# EAGLE design LoRa_Plug (EAGLE 9.2.0)
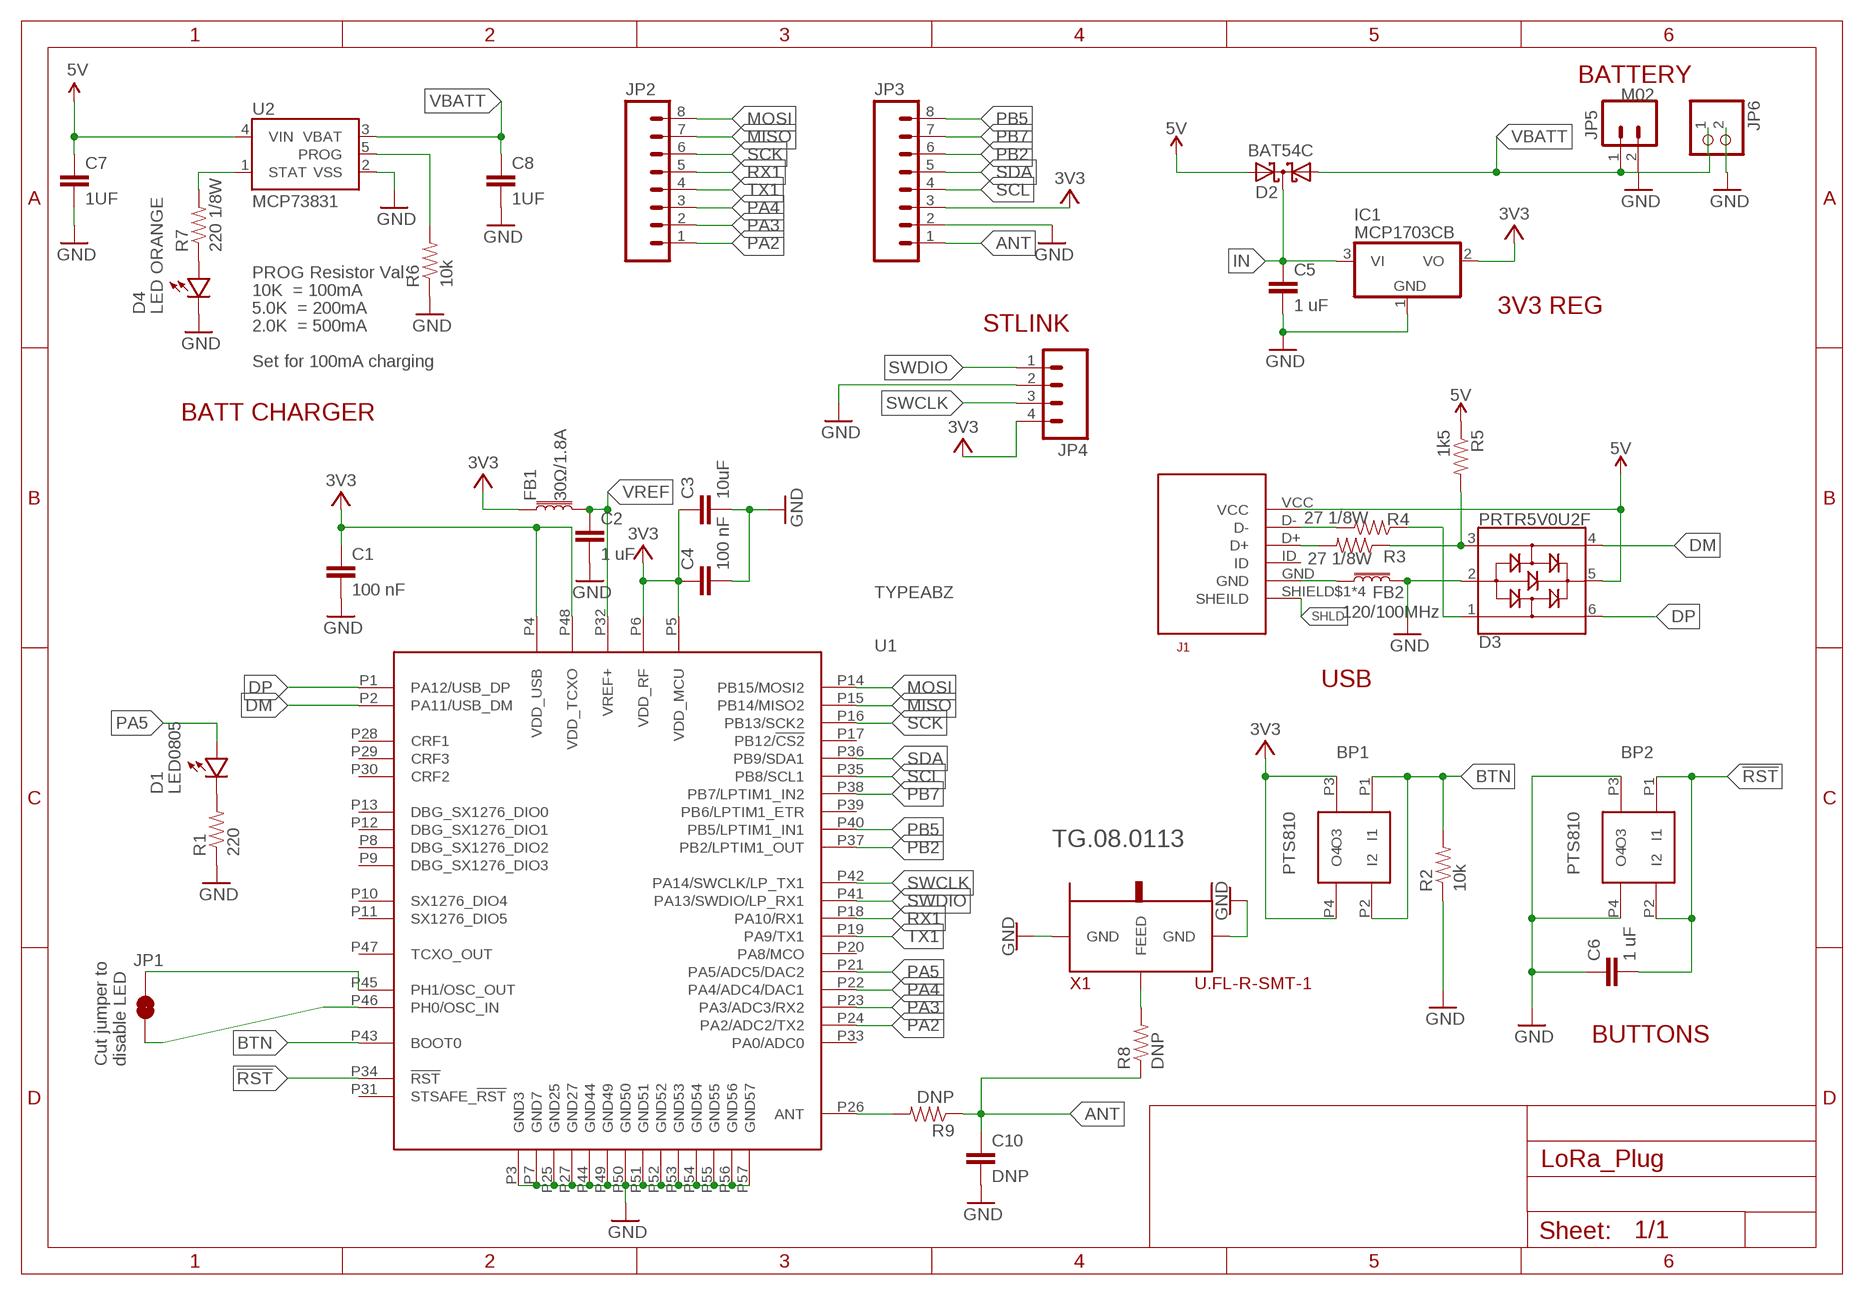
[diagram p0: schematic, sheet 1]

## Parts
BP1  PTS810  C&KTACTILESWITCH  [C&KTACTILESWITCH]
BP2  PTS810  C&KTACTILESWITCH  [C&KTACTILESWITCH]
C1  100 nF  CAP0603-CAP  [0603-CAP]
C2  1 uF  CAP0603-CAP  [0603-CAP]
C3  10uF  CAP0603-CAP  [0603-CAP]
C4  100 nF  CAP0603-CAP  [0603-CAP]
C5  1 uF  CAP0603-CAP  [0603-CAP]
C6  1 uF  CAP0603-CAP  [0603-CAP]
C7  1UF  CAP0603-CAP  [0603-CAP]
C8  1UF  CAP0603-CAP  [0603-CAP]
C10  DNP  CAP0603-CAP  [0603-CAP]
D1  LED0805  [0805-LED]
D2  BAT54C  [SOT23]
D3  PRTR5V0U2F  [SOT886]
D4  LED ORANGE  LED0805  [0805-LED]
FB1  30Ω/1.8A  FERRITE_BEAD-0603  [0603]
FB2  120/100MHz  FERRITE_BEAD-0603  [0603]
IC1  MCP1703CB  [SOT23]
J1  10118193-0001LF  [10118193-0001LF]
JP1  JUMPER-SMT_2_NC_TRACE_SILK  [SMT-JUMPER_2_NC_TRACE_SILK]
JP2  M08  [1X08]
JP3  M08  [1X08]
JP4  M04PTH  [1X04]
JP5  M02  [1X02]
JP6  JST_2PIN-THM  [JST-PH-2-THM]
R1  220  RESISTOR0603-RES  [0603-RES]
R2  10k  RESISTOR0603-RES  [0603-RES]
R3  27 1/8W  RESISTOR0603-RES  [0603-RES]
R4  27 1/8W  RESISTOR0603-RES  [0603-RES]
R5  1k5  RESISTOR0603-RES  [0603-RES]
R6  10k  RESISTOR0603-RES  [0603-RES]
R7  220 1/8W  RESISTOR0805  [0805]
R8  DNP  RESISTOR0603-RES  [0603-RES]
R9  DNP  RESISTOR0603-RES  [0603-RES]
U1  TYPEABZ  [TYPEABZ]
U2  MCP73831  [SOT23-5:1]
X1  U.FL-R-SMT-1  [U.FL-R-SMT-1]

## Nets
3V3: BP1.P3(O3) BP1.P4(O4) C1.1 C3.1 C4.1 FB1.1 IC1.2(VO) JP3.3 JP4.4 U1.P4(VDD_USB) U1.P5(VDD_MCU) U1.P6(VDD_RF) U1.P48(VDD_TCXO)
5V: C7.1 D2.2(A2) D3.5 J1.VCC R5.1 U2.4(VIN)
!RST: BP2.P1(I1) BP2.P2(I2) C6.2 U1.P34(!RST)
ANT: C10.1 JP3.1 R8.1 R9.1
BTN: BP1.P1(I1) BP1.P2(I2) R2.2 U1.P43(BOOT0)
DM: D3.4 U1.P2(PA11/USB_DM)
DP: D3.6 U1.P1(PA12/USB_DP)
GND: BP2.P3(O3) BP2.P4(O4) C1.2 C2.2 C3.2 C4.2 C5.2 C6.1 C7.2 C8.2 C10.2 D3.2 D4.MINUS FB2.2 IC1.1(GND) JP3.2 JP4.2 JP5.2 JP6.2 R1.1 R2.1 R6.1 U1.P3(GND3) U1.P7(GND7) U1.P25(GND25) U1.P27(GND27) U1.P44(GND44) U1.P49(GND49) U1.P50(GND50) U1.P51(GND51) U1.P52(GND52) U1.P53(GND53) U1.P54(GND54) U1.P55(GND55) U1.P56(GND56) U1.P57(GND57) U2.2(VSS) X1.P$1(GND) X1.P$2(GND)
IN: C5.1 D2.3(CC) IC1.3(VI)
MISO: JP2.7 U1.P15(PB14/MISO2)
MOSI: JP2.8 U1.P14(PB15/MOSI2)
N$1: D1.MINUS R1.2
N$2: R9.2 U1.P26(ANT)
N$6: JP1.2 U1.P45(PH1/OSC_OUT)
N$8: J1.D- R4.2
N$10: J1.D+ R3.2
N$11: FB2.1 J1.GND
N$12: JP1.1 U1.P46(PH0/OSC_IN)
N$15: D4.PLUS R7.1
N$28: R8.2 X1.P$3(FEED)
PA2: JP2.1 U1.P24(PA2/ADC2/TX2)
PA3: JP2.2 U1.P23(PA3/ADC3/RX2)
PA4: JP2.3 U1.P22(PA4/ADC4/DAC1)
PA5: D1.PLUS U1.P21(PA5/ADC5/DAC2)
PB2: JP3.6 U1.P37(PB2/LPTIM1_OUT)
PB5: JP3.8 U1.P40(PB5/LPTIM1_IN1)
PB7: JP3.7 U1.P38(PB7/LPTIM1_IN2)
PROG1: R6.2 U2.5(PROG)
RX1: JP2.5 U1.P18(PA10/RX1)
SCK: JP2.6 U1.P16(PB13/SCK2)
SCL: JP3.4 U1.P35(PB8/SCL1)
SDA: JP3.5 U1.P36(PB9/SDA1)
SHLD: J1.SHIELD$1(SHEILD) J1.SHIELD$2(SHEILD) J1.SHIELD$3(SHEILD) J1.SHIELD$4(SHEILD)
STAT1: R7.2 U2.1(STAT)
SWCLK: JP4.3 U1.P42(PA14/SWCLK/LP_TX1)
SWDIO: JP4.1 U1.P41(PA13/SWDIO/LP_RX1)
TX1: JP2.4 U1.P19(PA9/TX1)
USB_D+: D3.3 R3.1 R5.2
USB_D-: D3.1 R4.1
VBATT: C8.1 D2.1(A1) JP5.1 JP6.1 U2.3(VBAT)
VREF: C2.1 FB1.2 U1.P32(VREF+)
Unconnected: J1.ID U1.P8(DBG_SX1276_DIO2) U1.P9(DBG_SX1276_DIO3) U1.P10(SX1276_DIO4) U1.P11(SX1276_DIO5) U1.P12(DBG_SX1276_DIO1) U1.P13(DBG_SX1276_DIO0) U1.P17(PB12/!CS2) U1.P20(PA8/MCO) U1.P28(CRF1) U1.P29(CRF3) U1.P30(CRF2) U1.P31(STSAFE_!RST) U1.P33(PA0/ADC0) U1.P39(PB6/LPTIM1_ETR) U1.P47(TCXO_OUT)

## Notes on the sheet
- BATTERY
- PROG Resistor Val:
- 10K  = 100mA | 3V3 REG
- 5.0K  = 200mA | STLINK
- 2.0K  = 500mA
- Set for 100mA charging
- BATT CHARGER
- USB
- TG.08.0113
- BUTTONS
- Cut jumper to 
  disable LED

## Library data of the parts
BP1 BP2 = LoRa.v01h:C&KTACTILESWITCH: C&K Tactile Switch 611-PTS810SJS250SMTR
C1-C6 C10 = UNodino:CAP: Capacitor Standard 0603 ceramic capacitor, and 0.1" leaded capacitor.
C7 C8 = UNodino:CAP: Capacitor Standard 0603 ceramic capacitor, and 0.1" leaded capacitor.; STOCK: CAP C22UF 6.3V X5R 0805
D1 = UNodino:LED
D2 = diode:BAT54C: Schottky Diodes Source: Fairchild .. BAT54.pdf
D3 = Nively001:PRTR5V0U2; DIGIKEY: 1727-4161-1-ND
D4 = UNodino:LED; DIGIKEY: 160-1413-2-ND
FB1 = Nively001:FERRITE_BEAD: Ferrite Bead (blocks, cores, rings, chokes, etc.) Inductor with layers of ferrite used to suppress high frequencies. Often used to isolate high frequency noise. SparkFun Products: IOIO-OTG - V2.2 <https://www.sparkfun.com/products/13613> SparkFun SAMD21 Mini Breakout <https://www.sparkfun.com/products/13664> SparkFun 6 Degrees of Freedom Breakout - LSM6DS3 <https://www.sparkfun.com/products/13339> SparkFun SAMD21 Dev Breakout <https://www.sparkfun.com/products/13672>; DIGIKEY: BLM18EG331TN1D; PROD_ID: NDUC-13805
FB2 = Nively001:FERRITE_BEAD: Ferrite Bead (blocks, cores, rings, chokes, etc.) Inductor with layers of ferrite used to suppress high frequencies. Often used to isolate high frequency noise. SparkFun Products: IOIO-OTG - V2.2 <https://www.sparkfun.com/products/13613> SparkFun SAMD21 Mini Breakout <https://www.sparkfun.com/products/13664> SparkFun 6 Degrees of Freedom Breakout - LSM6DS3 <https://www.sparkfun.com/products/13339> SparkFun SAMD21 Dev Breakout <https://www.sparkfun.com/products/13672>; DIGIKEY: BLM18EG331TN1D; PROD_ID: NDUC-13805; VALUE: 30Ω/1.8A
IC1 = gateway_finalV2:MCP1703: 250 mA, 16V, Low Quiescent Current LDO Regulator Source: http://ww1.microchip.com/downloads/en/DeviceDoc/22049b.pdf
J1 = 10118193-0001LF:10118193-0001LF; STOCK: CONN RCPT USB2.0 MICRO B SMD R/A
JP1 = SparkFun-Jumpers:JUMPER-SMT_2_NC_TRACE: Normally closed trace jumper This jumper has a trace between two pads so it's normally closed (NC). Use a razor knife to open the connection. For best results follow the IPC guidelines for cutting traces: Cutout at least 0.063 mm (0.005 in). Remove all loose material to clean up the cut area. Seal the cut with an approved epoxy. Reapply solder to reclose the connection.
JP2 JP3 = SparkFun-2010:M08: Header 8 Standard 8-pin 0.1" header. Use with straight break away headers (SKU : PRT-00116), right angle break away headers (PRT-00553), swiss pins (PRT-00743), machine pins (PRT-00117), and female headers (PRT-00115).
JP4 = SparkFun-2010:M04: Header 4 Standard 4-pin 0.1" header. Use with straight break away headers (SKU : PRT-00116), right angle break away headers (PRT-00553), swiss pins (PRT-00743), machine pins (PRT-00117), and female headers (PRT-00115). Molex polarized connector foot print use with SKU : PRT-08231 with associated crimp pins and housings.
JP5 = SparkFun-Connectors:M02
JP6 = adafruit:JST_2PIN: JST 2-Pin Connectors of various flavors SMT-RA (S2B-PH-SM4) 4UConnector #17311 SMT (B2B-PH-SM4) THM-RA (S2B-PH) THM (B2B-PH)
R1 R2 R8 R9 = UNodino:RESISTOR: Resistor Basic schematic elements and footprints for 0603, 1206, and PTH resistors.
R3-R5 = UNodino:RESISTOR: Resistor Basic schematic elements and footprints for 0603, 1206, and PTH resistors.; STOCK: RES SMD 27 OHM 5% 1/8W 0805
R6 = UNodino:RESISTOR: Resistor Basic schematic elements and footprints for 0603, 1206, and PTH resistors.; STOCK: RES SMD 2K2 OHM 5% 1/10W 0603
R7 = UNodino:RESISTOR: Resistor Basic schematic elements and footprints for 0603, 1206, and PTH resistors.; DIGIKEY: A129741TR-ND
U1 = LoRa.v01h:TYPEABZ: CMWX1ZZABZ-078
U2 = Nively001:MCP73831: Miniature single cell, fully integrated Li-Ion, Li-polymer charge management controller http://ww1.microchip.com/downloads/en/DeviceDoc/20001984g.pdf IC-09995; DIGIKEY: MCP73831T-2DCI/OTCT-ND; PROD_ID: IC-09995
X1 = gateway_finalV2:U.FL-R-SMT-1: Connecteur coaxial / RF, Coaxial U.FL, Jack droit, Montage en surface vertical, 50 ohm, Laiton; STOCK: U.FL-R-SMT-1(10) - Connecteur coaxial / RF, Coaxial U.FL

## Net classes
0 default: clearance 0.127 mm

## Board
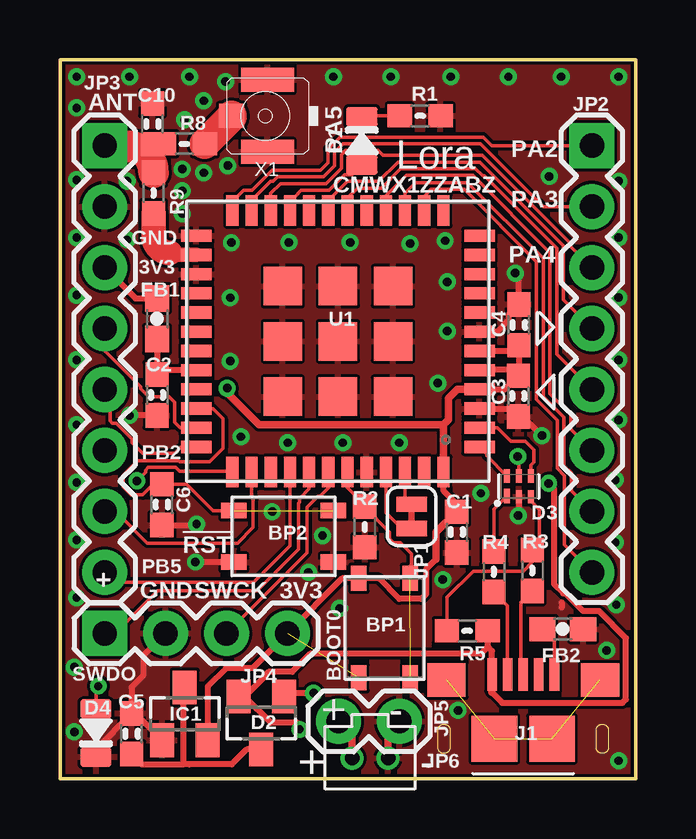
[diagram p1: board, top side]
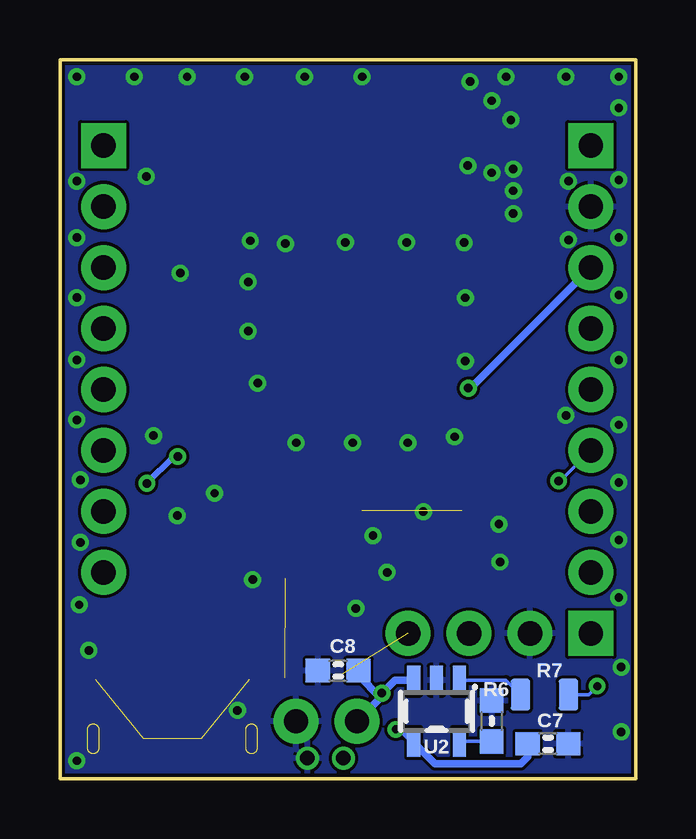
[diagram p2: board, bottom side, seen from below]

Size 24 x 29.94 mm. Coordinates in mm from the lower left corner, seen from the top.
Outline: 24,29.94 0,29.94 0,0 24,0 24,29.94
Copper layers (1*16): Top 0.0356mm / dielectric 1.5011mm / Bottom 0.0356mm
Design rules "my_2_layer *": minimum track width 6mil, minimum drill 13mil, track to track 5mil, track to pad 5mil, pad to pad 5mil, via to via 6mil, smd to smd 5mil, copper to edge 5mil, drill to drill 5mil, minimum pad ring 7mil, minimum via ring 7mil, stop-mask expansion 2.5mil, vias tented up to drill 20mil, thermal gap 5mil

### Footprints (pad centres in the part's own frame; a part is rotated, then mirrored left to right if it is on the bottom)
C&KTACTILESWITCH = smd 1.05 x 0.65: P1 -2.075,1.073; P2 2.075,1.075; P3 -2.075,-1.075; P4 2.075,-1.075
0603-CAP = smd 1.016 x 0.965: 1 -0.85,0; 2 0.85,0
0805-LED = smd 0.8 x 1.3: MINUS -1,0; PLUS 1,0
SOT23 = smd 1 x 1.4: 1 -0.95,-1.1; 2 0.95,-1.1; 3 0,1.1
SOT886 = smd 0.61 x 0.25: 1 -0.405,0.5 | smd 0.56 x 0.25: 2 -0.43,0; 3 -0.43,-0.5; 4 0.43,-0.5; 5 0.43,0; 6 0.43,0.5
0603 = smd 1.1 x 1: 1 -0.85,0; 2 0.85,0
10118193-0001LF = smd 0.4 x 1.35: D+ 0,2.675; D- -0.65,2.675; GND 1.3,2.675; ID 0.65,2.675; VCC -1.3,2.675 | smd 1.6 x 1.4: SHIELD$1 -3.2,2.45; SHIELD$2 3.2,2.45 | smd 1.9 x 1.9: SHIELD$3 -1.2,0; SHIELD$4 1.2,0
SMT-JUMPER_2_NC_TRACE_SILK = smd 0.635 x 1.27: 1 -0.508,0; 2 0.508,0
1X08 = drill 1.016 pad 1.88 square: 1 0,0 | drill 1.016 pad 1.88: 2 2.54,0; 3 5.08,0; 4 7.62,0; 5 10.16,0; 6 12.7,0; 7 15.24,0; 8 17.78,0
1X04 = drill 1.016 pad 1.88 square: 1 0,0 | drill 1.016 pad 1.88: 2 2.54,0; 3 5.08,0; 4 7.62,0
1X02 = drill 1 pad 1.88: 1 0,0; 2 2.54,0
JST-PH-2-THM = drill 0.6: 1 0.5,0; 2 -1,0
0603-RES = smd 1.016 x 0.965: 1 -0.85,0; 2 0.85,0
0805 = smd 0.8 x 1.3: 1 -1,0; 2 1,0
TYPEABZ = smd 1.27 x 0.508: P1 -5.904,4.4; P2 -5.904,3.6; P3 -5.904,2.8; P4 -5.904,2; P5 -5.904,1.2; P6 -5.904,0.4; P7 -5.904,-0.4; P8 -5.904,-1.2; P9 -5.904,-2; P10 -5.904,-2.8; P11 -5.904,-3.6; P12 -5.904,-4.4; P25 5.904,-4.4; P26 5.904,-3.6; P27 5.904,-2.8; P28 5.904,-2; P29 5.904,-1.2; P30 5.904,-0.4; P31 5.904,0.4; P32 5.904,1.2; P33 5.904,2; P34 5.904,2.8; P35 5.904,3.6; P36 5.904,4.4 | smd 0.508 x 1.27: P13 -4.4,-5.454; P14 -3.6,-5.454; P15 -2.8,-5.454; P16 -2,-5.454; P17 -1.2,-5.454; P18 -0.4,-5.454; P19 0.4,-5.454; P20 1.2,-5.454; P21 2,-5.454; P22 2.8,-5.454; P23 3.6,-5.454; P24 4.4,-5.454; P37 4.4,5.454; P38 3.6,5.454; P39 2.8,5.454; P40 2,5.454; P41 1.2,5.454; P42 0.4,5.454; P43 -0.4,5.454; P44 -1.2,5.454; P45 -2,5.454; P46 -2.8,5.454; P47 -3.6,5.454; P48 -4.4,5.454 | smd 1.6 x 1.6: P49 -2.3,2.3; P50 0,2.3; P51 2.3,2.3; P52 -2.3,0; P53 0,0; P54 2.3,0; P55 -2.3,-2.3; P56 0,-2.3; P57 2.3,-2.3
SOT23-5:1 = smd 0.55 x 1.2: 1 -0.95,-1.3; 2 0,-1.3; 3 0.95,-1.3; 4 0.95,1.3; 5 -0.95,1.3
U.FL-R-SMT-1 = smd 1 x 2.2: P$1 -1.5,-0.1; P$2 1.5,-0.1 | smd 1 x 1.05: P$3 0,1.4

### Placement (x,y rotation side)
BP1  13.54,6.27 270 top
BP2  9.32,10.09 0 top
C1  16.54,10.27 270 top
C2  4.05,15.98 270 top
C3  19.11,15.93 270 top
C4  19.14,18.9 90 top
C5  2.99,1.87 90 top
C6  4.25,11.41 90 top
C7  3.65,1.45 0 bottom
C8  12.4,4.5 180 bottom
C10  3.86,27.28 90 top
D1  12.59,26.57 270 top
D2  8.39,2.32 180 top
D3  19.14,12.17 90 top
D4  1.5,1.9 90 top
FB1  4.05,19.16 270 top
FB2  20.96,6.23 0 top
IC1  5.21,2.7 0 top
J1  19.31,1.66 0 top
JP1  14.66,10.93 270 top
JP2  22.18,26.37 270 top
JP3  1.86,26.37 270 top
JP4  1.86,6.05 0 top
JP5  11.61,2.38 0 top
JP6  12.68,0.85 180 top
R1  15.02,27.61 180 top
R2  12.71,10.49 90 top
R3  19.69,8.67 270 top
R4  18.09,8.62 270 top
R5  16.99,6.16 180 top
R6  6,2.4 270 bottom
R7  3.8,3.5 180 bottom
R8  5.19,26.45 0 top
R9  3.9,24.4 270 top
U1  11.59,18.22 180 top
U2  8.3,2.8 180 bottom
X1  8.56,27.61 90 top

### Tracks (layer width: path | path; a pad name or v marks a point on that pad's centre or on a via)
3V3  (via drill 0.35)  (1 unrouted)
  Top 0.254: JP3.3 3.15,20.01 FB1.1 | C4.1 19.14,17.74 | 19.14,17.74 19.14,17.05 | 19.14,17.05 19.14,16.81 C3.1 18.55,16.22 U1.P4 | U1.P6 19.05,17.82 19.14,17.74 | U1.P5 17.53,17.05 19.14,17.05 | C1.1 16.54,11.44 15.99,11.99 U1.P48 | IC1.2 6.16,3.84 6.92,4.6 8.04,4.6 JP4.4 11.77,8.34 BP1.P3 | 15.68,9.14 15.27,8.72 15.27,7.69 15.07,7.49 14.15,7.49 13.3,8.34 BP1.P3 | BP1.P3
  Top 0.305: C1.1 15.68,10.26 15.68,9.14 | v6.97,16.27 6.97,16.07 8.29,14.75 15.99,14.75 | U1.P4 16.57,16.22 16.2,15.85 16.2,14.96 15.99,14.75 | U1.P48 15.99,14.75
  Bottom 0.305: JP3.3 6.88,16.27 v6.97,16.27
5V  (via drill 0.33, 0.35)
  Top 0.152: D3.5 19.14,13.37 v19.09,13.42
  Top 0.254: J1.VCC 18.01,5.31 17.84,5.48 | 7.7,3.42 8.8,2.32 9.91,2.32 9.91,2.13 v10,2.05 | 7.7,3.42 D2.2 | 17.84,5.48 R5.1 | 17.84,5.48 17.55,5.2 10.43,5.2 9.68,4.45 8.7,4.45 8.51,4.26 8.51,4.23 7.7,3.42 | v20.38,12.3 20.6,12.08 20.6,8.1 20.99,7.71 21.08,7.71 21.81,6.98 22.47,6.98 23.6,5.85 23.6,3.3 23.45,3.15 18.45,3.15 18.01,3.59
  Top 0.305: J1.VCC 18.01,3.59
  Bottom 0.254: v10,2.05 9.8,2.05 U2.4 | v20.38,12.3 19.26,13.42 v19.09,13.42
  Bottom 0.305: U2.4 8.36,0.61 4.79,0.61 4.5,0.9 C7.1
!RST  (1 unrouted)
  Top 0.152: BP2.P1 6.38,11.16 5.28,12.26 C6.2 3.89,12.26 3.45,11.82 2.97,11.82 2.63,12.16 2.63,12.64 3.24,13.25 4.93,13.25 4.99,13.19 6.24,13.19 6.8,13.76 6.8,15 6.38,15.42 U1.P34
ANT
  Top 0.254: 2.8,26.3 3.73,26.3 C10.1 4.32,26.43 R8.1
  Top 1.27: 2.8,26.3 1.93,26.3 arc-90 JP3.1 2.78,26.37 arc-90 R9.1
BTN  (1 unrouted)
  Top 0.152: 12.71,11.76 12.71,11.4 | 12.71,11.4 R2.2 12.71,11.3 | BP1.P1 14.61,8.47 | 12.04,12.71 U1.P43 11.99,12.12 12.71,11.4 | 12.71,11.09 12.71,11.3 | 12.71,11.3 13.75,10.26 13.75,9.98 13.91,9.82 14.19,9.82 14.65,9.36 14.65,8.81
  Top 0.254: BP1.P1 14.65,8.39 14.65,8.81
DM
  Top 0.152: U1.P2 18.24,14.62 18.8,14.06 19.41,14.06 19.77,13.71 19.77,13.18 19.64,13.04 D3.4
DP
  Top 0.152: U1.P1 17.8,13.52 17.8,13.44 D3.6
GND  (via drill 0.35)
  Top 0.254: U1.P3 18.77,15.42 C3.2 19.3,15.08 v20.1,14.29 | v18.98,21.06 19.14,20.91 C4.2 18.73,19.35 18.73,19.13 18.21,18.62 U1.P7 | D3.2 19.14,10.98 v19.11,10.95 | 20.92,7.33 20.92,7.12 | JP4.2 3.46,5.11 3.46,4.27 2.99,3.8 C5.2 | IC1.1 3.14,2.72 C5.2 | C2.2 v2.9,15.13 | C6.1 5.66,10.56 v5.7,10.6 | BP2.P3 v5.66,9.02 v5.65,9.02 | C5.2 1.5,1.23 D4.MINUS
  Top 0.305: JP6.2 13.68,1.91 JP5.2
  other vias: 15.96,8.29 15.76,16.48 7.1,17.39 7.15,22.33 16.06,22.41 2.8,22.44 5.1,23.54 10.95,10.12 17.55,11.89 7.1,20.03 9.55,22.34 12.1,22.34 14.6,22.29 16.15,20.69 16.15,18.64 7.55,14.24 9.5,13.99 11.8,13.99 14.15,13.99 5.1,24.49 7,25.54 0.7,24.94 0.7,22.54 0.7,20.14 0.7,17.44 0.7,14.74 0.7,12.34 0.7,9.94 0.7,7.54 0.6,4.64 0.6,1.94 0.7,27.94 0.7,29.24 2.9,29.24 5.4,29.24 11.4,29.24 13.8,29.24 16.3,29.24 18.7,29.24 20.9,29.24 23.3,29.24 23.3,24.89 23.3,22.54 23.3,20.04 23.3,17.44 23.3,14.94 23.15,12.44 23.15,9.84 23.2,7.24 22.8,5.34 23.3,0.74 16.6,2.84 11.66,7.09 10.36,8.59 8.85,11.12 5.1,25.39 2.8,24.89 6,25.24 5.2,27.44 6,28.24 6.9,29.04 20.4,25.09
  pour Bottom: 24.3,-3.5 24.3,31.04 -0.2,31.04 -0.2,-3.5
  pour Top: -1.8,31.04 24.8,31.04 24.8,-1 -1.8,-1
IN
  Top 0.254: IC1.3 5.15,3.74 5.15,0.59 | D2.3 7.79,1.22 7.16,0.59 5.4,0.59 5.15,0.59 | C5.1 3.41,0.59 5.15,0.59
MISO
  Top 0.152: U1.P15 14.39,24.4 14.82,24.82 17,24.82 20.15,21.67 20.15,15.92 21.02,15.05 21.02,13.04 21.32,12.73 21.32,11.99 JP2.7
MOSI
  Top 0.152: U1.P14 15.19,24.26 15.48,24.55 16.86,24.55 19.87,21.53 19.87,15.8 20.73,14.94 20.73,12.92 21.04,12.62 21.04,9.73 JP2.8
N$1
  Top 0.152: R1.2 12.63,27.61 D1.MINUS
N$2
  Top 0.61: U1.P26 4.68,21.82 4.6,21.9
  Top 1.016: 4.6,21.9 arc-90 3.9,22.6 R9.2
N$6
  Top 0.152: U1.P45 13.59,11.07 14.28,10.38 14.63,10.38 JP1.2
N$8
  Top 0.152: J1.D- 18.66,7.2 R4.2
N$10
  Top 0.152: J1.D+ 19.21,4.43 19.21,7.34 R3.2
N$11
  Top 0.152: J1.GND 20.61,5.73 FB2.1
N$12
  Top 0.152: 14.39,11.51 U1.P46
  Top 0.254: JP1.1 14.59,11.51 14.39,11.51
N$15  (via drill 0.33)
  Top 0.152: v1.6,3.85 1.5,3.75 D4.PLUS
  Bottom 0.152: R7.1 1.95,3.5 v1.6,3.85
N$28
  Top 1.27: X1.P$3 7.16,27.57 R8.2
PA2
  Top 0.152: JP2.1 18.01,26.37 17.65,26.73 11.68,26.73 11.18,26.23 11.18,25.66 10.87,25.35 8.85,25.35 8.01,24.51 7.65,24.51 7.19,24.05 U1.P24
PA3
  Top 0.152: JP2.2 20.15,23.83 17.53,26.45 11.8,26.45 11.52,26.18 11.46,26.11 11.46,25.54 10.98,25.07 9.07,25.07 8.88,24.88 8.78,24.88 7.99,24.09 U1.P23
PA4
  Top 0.152: JP2.3 21.27,22.21 21.27,22.32 17.62,25.97 13.47,25.97 13.26,26.17 11.91,26.17 11.74,25.99 11.74,25.43 11.1,24.79 9.19,24.79 8.79,24.39 U1.P22
PA5
  Top 0.152: U1.P21 9.59,24.03 9.67,24.11 9.93,24.37 9.93,24.39 10.05,24.51 11.21,24.51 11.86,25.16 12.18,25.16 D1.PLUS
PB2  (via drill 0.35)
  Top 0.152: U1.P37 7.16,12.8 4.99,12.8 4.82,12.97 3.68,12.97 3.56,12.85 3.56,12.76 v3.21,12.4
  Bottom 0.152: JP3.6 3.13,12.4 v3.21,12.4
PB5
  Top 0.152: JP3.8 2.27,8.19 6.94,8.19 7.07,8.19 8.07,8.19 9.59,9.71 9.59,11.61 9.59,11.62 U1.P40
PB7
  Top 0.152: JP3.7 2.32,11.13 3.64,9.81 7.4,9.81 8.05,10.47 8.05,11.7 7.99,11.77 U1.P38
PROG1
  Bottom 0.152: R6.2 7.3,1.55 U2.5
RX1
  Top 0.152: JP2.5 20.71,17.68 20.71,22.09 17.69,25.11 17.63,25.11 17.33,25.41 14.21,25.41 13.4,24.6 12.4,24.6 11.99,24.19 U1.P18
SCK
  Top 0.152: U1.P16 13.55,23.72 13.55,24.24 14.44,25.13 17.21,25.13 20.43,21.91 20.43,16.03 21.29,15.17 21.29,14.56 JP2.6
SCL
  Top 0.152: U1.P35 5.01,14.62 4.78,14.84 4.78,15.25 4.78,15.68 4.55,15.91 3.7,15.91 3.36,16.24 3.36,16.33 1.86,17.83 JP3.4
SDA
  Top 0.152: U1.P36 5.06,13.82 4.79,13.55 3.45,13.55 3.01,13.99 3.01,14.14 2.34,14.82 2.18,14.82 2.1,14.9 2.1,15.98 JP3.5
SHLD  (3 unrouted)
STAT1
  Bottom 0.152: U2.1 5.4,4.1 R7.2
SWCLK
  Top 0.152: U1.P42 11.19,12.11 10.85,11.77 10.76,11.77 10.3,11.31 10.3,9.41 JP4.3
SWDIO
  Top 0.152: JP4.1 2.29,6.05 4.07,7.83 8.21,7.83 9.94,9.56 9.94,11.46 9.99,11.51 9.99,11.66 10.39,12.06 U1.P41
TX1
  Top 0.152: JP2.4 20.99,19.95 20.99,22.2 17.51,25.69 14.09,25.69 13.28,24.88 11.98,24.88 11.19,24.09 U1.P19
USB_D+
  Top 0.152: D3.3 19.64,11.57 20,11.21 20,9.82 R3.1 19.69,9.02 19.31,8.64 17.23,8.64 16.14,7.55 R5.2
USB_D-
  Top 0.152: D3.1 18.09,11.23 R4.1
VBATT  (via drill 0.35)
  Top 0.254: v10.57,3.56 9.48,3.56 D2.1
  Top 0.305: JP6.1 12.18,1.81 JP5.1
  Bottom 0.305: v10.57,3.56 10.52,3.62 | 10.52,3.62 10.04,4.1 U2.3 | v10.57,3.56 10.57,3.42 JP5.1 | 10.52,3.67 10.52,3.62 | v10.57,3.56 10.81,3.56 11.38,4.12 | 11.38,4.12 11.55,4.3 | C8.1 11.38,4.33 11.38,4.12
VREF
  Top 0.254: U1.P32 4.23,17.02 C2.1 FB1.2

### Text on the board
tPlace: ANT | PA5 | PA2 | Lora | CMWX1ZZABZ | PA3 | GND | PA4 | 3V3 | PB2 | !RST | PB5 | + | GND | SWCK | 3V3 | SWDO | BOOT0 | + | -
tNames: X1